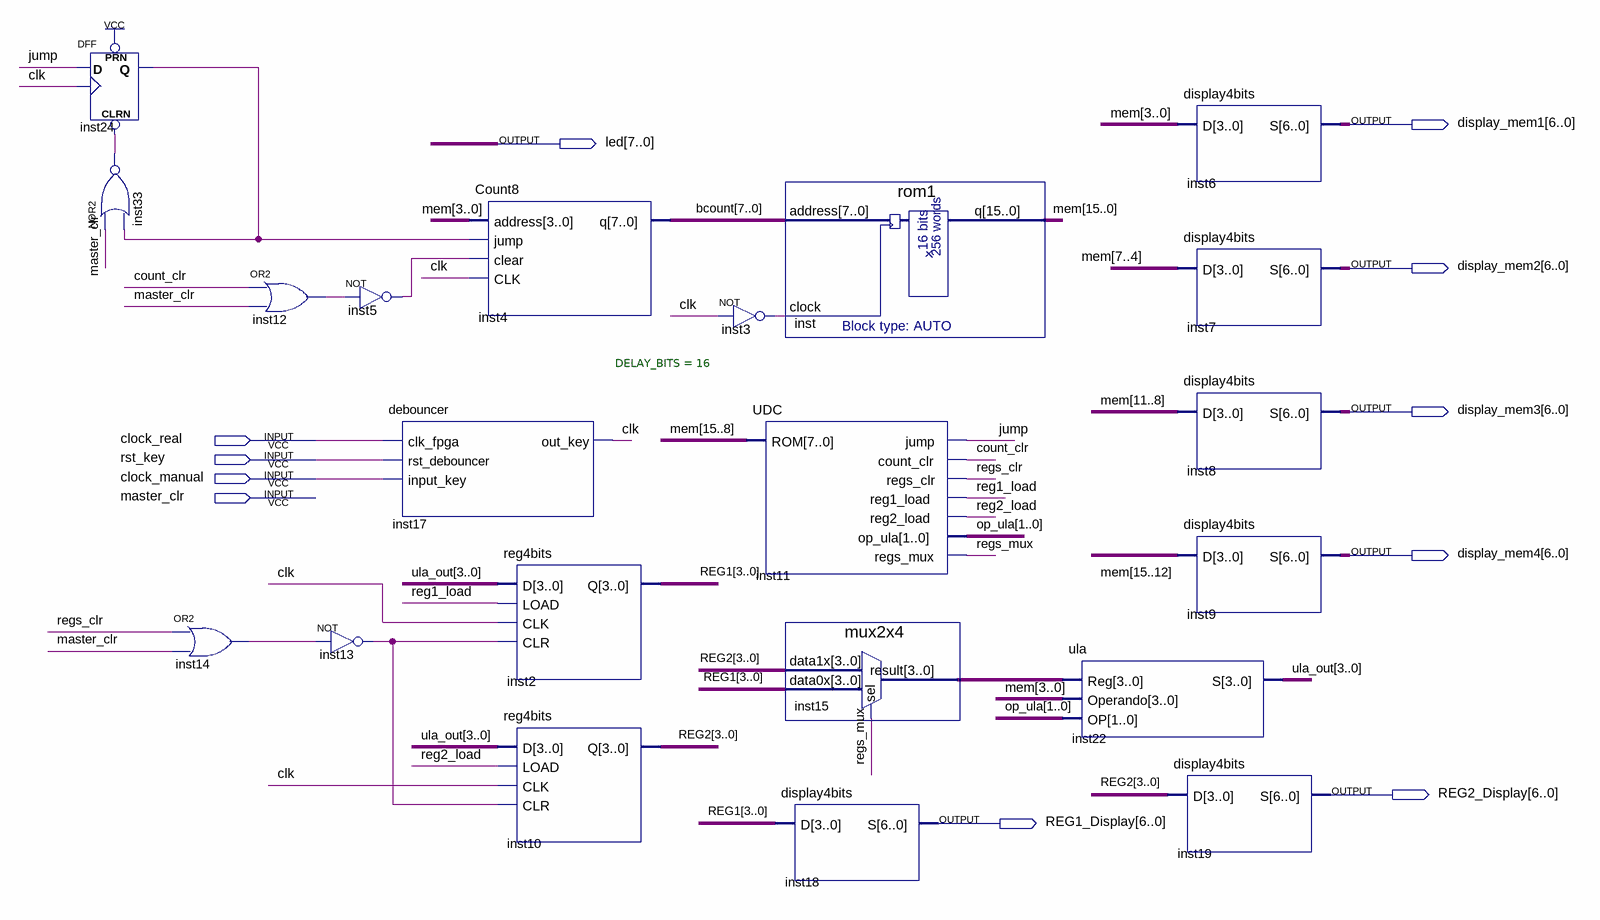
[diagram p0: schematic sheet]
// Quartus schematic CPU.bdf as structural Verilog: 21 symbols, 11 pins
module CPU (
  input  clock_real,
  input  rst_key,
  input  clock_manual,
  input  master_clr,
  output [6:0] display_mem1,
  output [7:0] led,
  output [6:0] display_mem2,
  output [6:0] display_mem3,
  output [6:0] display_mem4,
  output [6:0] REG2_Display,
  output [6:0] REG1_Display
);

  wire clk, count_clr, inst3_out, inst5_out, inst12_out, inst13_out, inst14_out, inst24_q, inst33_out, jump,
       reg1_load, reg2_load, regs_clr, regs_mux;
  wire [1:0] op_ula;
  wire [3:0] inst15_result, REG1, REG2, ula_out;
  wire [7:0] bcount;
  wire [15:0] mem;

  DFF inst24 (.CLRN(inst33_out), .CLK(clk), .D(jump), .PRN(1'b1), .Q(inst24_q));
  nor inst33 (inst33_out, master_clr, inst24_q);
  or inst14 (inst14_out, regs_clr, master_clr);
  or inst12 (inst12_out, count_clr, master_clr);
  not inst13 (inst13_out, inst14_out);
  not inst5 (inst5_out, inst12_out);
  debouncer #(.DELAY_BITS(16)) inst17 (
    .clk_fpga(clock_real), .rst_debouncer(rst_key), .input_key(clock_manual), .out_key(clk));
  Count8 inst4 (.address(mem[3:0]), .jump(inst24_q), .clear(inst5_out), .CLK(clk), .q(bcount));
  reg4bits inst2 (.D(ula_out), .LOAD(reg1_load), .CLK(clk), .CLR(inst13_out), .Q(REG1));
  reg4bits inst10 (.D(ula_out), .LOAD(reg2_load), .CLK(clk), .CLR(inst13_out), .Q(REG2));
  rom1 inst (.address(bcount), .clock(inst3_out), .q(mem));
  not inst3 (inst3_out, clk);
  UDC inst11 (
    .ROM(mem[15:8]), .jump(jump), .count_clr(count_clr), .regs_clr(regs_clr), .reg1_load(reg1_load),
    .reg2_load(reg2_load), .op_ula(op_ula), .regs_mux(regs_mux));
  mux2x4 inst15 (.data1x(REG2), .data0x(REG1), .sel(regs_mux), .result(inst15_result));
  display4bits inst18 (.D(REG1), .S(REG1_Display));
  ula inst22 (.Reg(inst15_result), .Operando(mem[3:0]), .OP(op_ula), .S(ula_out));
  display4bits inst19 (.D(REG2), .S(REG2_Display));
  display4bits inst6 (.D(mem[3:0]), .S(display_mem1));
  display4bits inst7 (.D(mem[7:4]), .S(display_mem2));
  display4bits inst8 (.D(mem[11:8]), .S(display_mem3));
  display4bits inst9 (.D(mem[15:12]), .S(display_mem4));
endmodule
